# Altium schematic sheet Sheet1.SchDoc
size A4; SheetNumber: 1; SheetTotal: 1
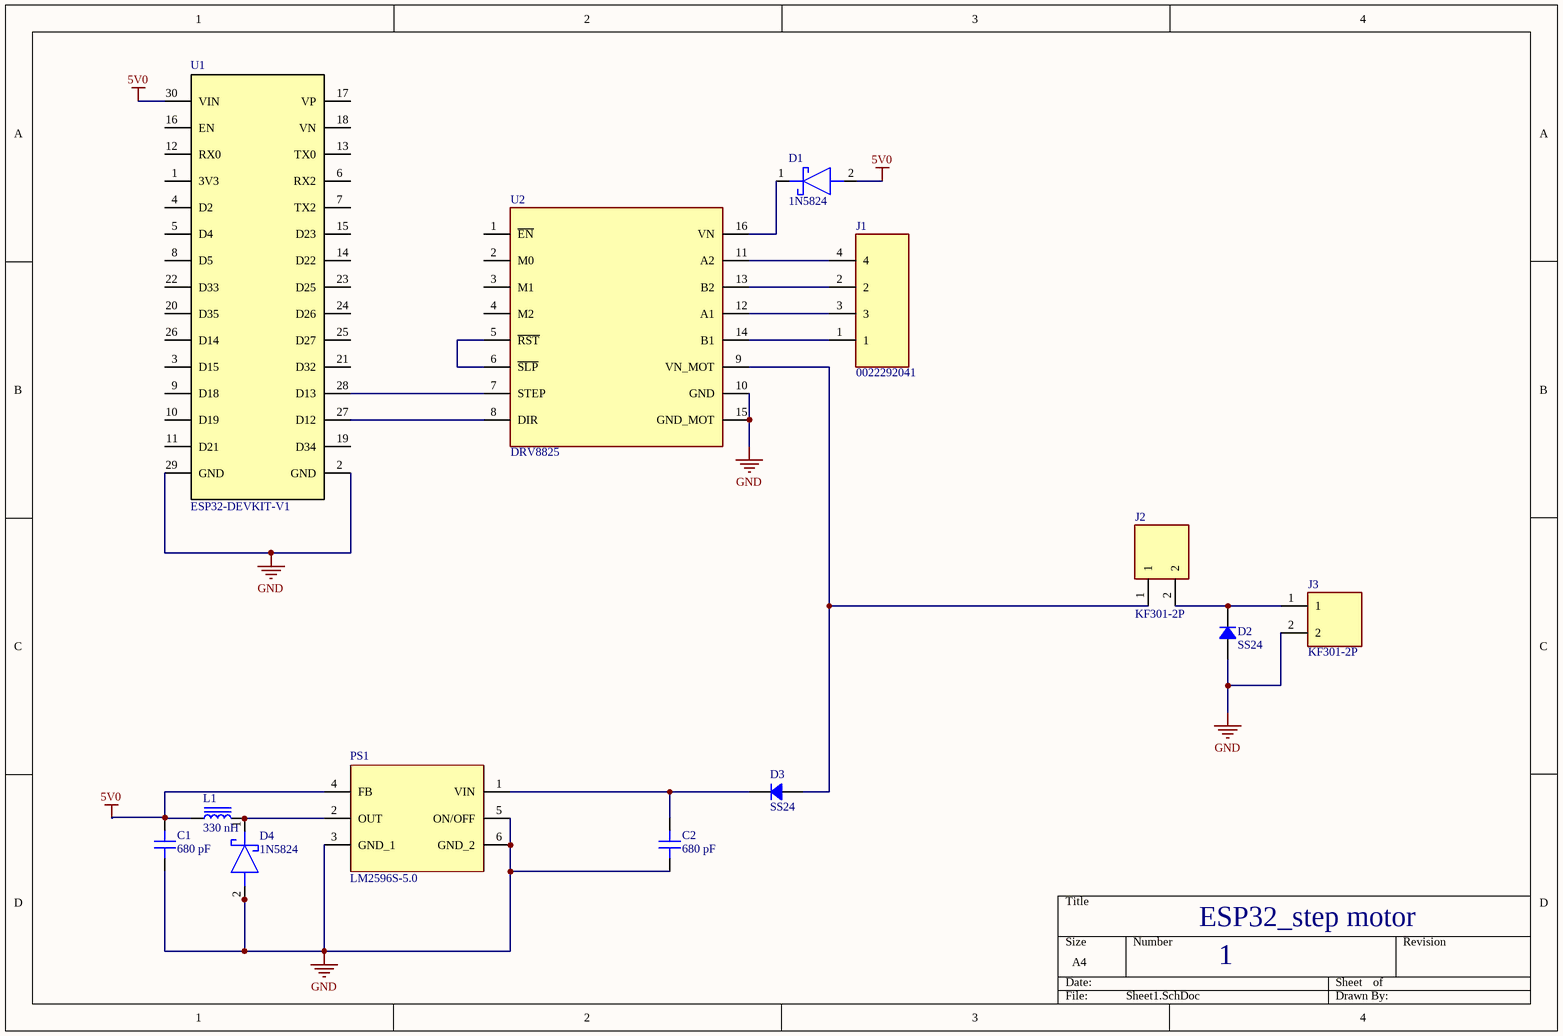
[diagram p0: Sheet1.SchDoc]

## Parts
C1  680 pF  [CAP 0603_1608]
C2  680 pF  [CAP 0603_1608]
D1  1N5824  [DIOM5026X262N]
D2  SS24  [DO214AA SMB]
D3  SS24  [DO214AA SMB]
D4  1N5824  [DIOM5026X262N]
J1  0022292041  [0022292041]
J2  KF301-2P  [HANDSON_KF301-2P]
J3  KF301-2P  [HANDSON_KF301-2P]
L1  330 nH  [BOURNS SRP5030T]
PS1  LM2596S-5.0  [KTT0005B]
U1  ESP32-DEVKIT-V1  [MODULE_ESP32_DEVKIT_V1]
U2  DRV8825  [IC_DRV8825_STEPPER_MOTOR_DRIVER_CARRIER]

## Nets
5V0: C1.2 D1.2(A) L1.1 PS1.4(FB) U1.30(VIN)
GND: C1.1 C2.1 D2.1 D4.2(A) J3.2 PS1.3(GND_1) PS1.5(ON/OFF) PS1.6(GND_2) U1.2(GND) U1.29(GND) U2.10(GND) U2.15(GND_MOT)
NetC2_2: C2.2 D3.2 PS1.1(VIN)
NetD1_1: D1.1(K) U2.16(VN)
NetD2_2: D2.2 J2.2 J3.1
NetD3_1: D3.1 J2.1 U2.9(VN_MOT)
NetD4_1: D4.1(K) L1.2 PS1.2(OUT)
NetJ1_1: J1.1 U2.14(B1)
NetJ1_2: J1.2 U2.13(B2)
NetJ1_3: J1.3 U2.12(A1)
NetJ1_4: J1.4 U2.11(A2)
NetU1_27: U1.27(D12) U2.8(DIR)
NetU1_28: U1.28(D13) U2.7(STEP)
NetU2_5: U2.5(~{RST}) U2.6(~{SLP})

Not connected (* = marked no-connect by the designer): U1 1(3V3) 3(D15) 4(D2) 5(D4) 6(RX2) 7(TX2) 8(D5) 9(D18) 10(D19) 11(D21) 12(RX0) 13(TX0) 14(D22) 15(D23) 16(EN) 17(VP) 18(VN) 19(D34) 20(D35) 21(D32) 22(D33) 23(D25) 24(D26) 25(D27) 26(D14); U2 1(~{EN}) 2(M0) 3(M1) 4(M2)

## Notes on the sheet
- ESP32_step motor
- 1

## Library data of the parts
C1 C2 = CC0603JRNPO9BN681: CAP CER 680PF 50V C0G/NPO 0603; manufacturer: Yageo; Temperature Coefficient: C0G, NP0; Tolerance: ±5%; Part Number: CC0603JRNPO9BN681; Capacitance: 680 pF; Applications: General Purpose; componentlink1description: Datasheet; componentlink1url: https://www.yageo.com/upload/media/product/productsearch/datasheet/mlcc/UPY-GP_NP0_16V-to-50V_17.pdf; componentlink2description: DigiKey Link; componentlink2url: https://www.digikey.com/en/products/detail/yageo/CC0603JRNPO9BN681/2833590; Device Package: 0603 (1608 Metric); lastupdated: 09.02.2024 20:10:17; Lifecycle Status: Active; Minimum Order: 1; Mounting Type: Surface Mount, MLCC; Operating Temperature: -55°C ~ 125°C; Package / Case: 0603 (1608 Metric); packaging: TapeAndReel; partid: 12488; Part Status: Active; price: 0.01; series: CC; Size / Dimension: 0.063" L x 0.031" W (1.60mm x 0.80mm); Supplier 1: DigiKey; Supplier Part Number 1: 311-1425-1-ND; Thickness (Max): 0.035" (0.90mm); value: 680 pF; Voltage - Rated: 50V
D1 D4 = 1N5824: Schottky Diode; Manufacturer_Name: Microchip; Datasheet Link: https://www.microsemi.com/document-portal/doc_download/5865-1n5823-25-datasheet; Height: 11.43mm; Manufacturer_Part_Number: 1N5824; Mouser Part Number: 494-1N5824; Mouser Price/Stock: https://www.mouser.co.uk/ProductDetail/Microchip-Technology/1N5824?qs=TXMzd3F6EyleEEWqakQxJw%3D%3D; Arrow Part Number: 1N5824; Arrow Price/Stock: https://www.arrow.com/en/products/1n5824/microchip-technology?utm_currency=USD&region=nac
D2 D3 = SS24: DIODE SCHOTTKY 40V 2A DO214AA; Manufacturer: ON Semiconductor; Current - Reverse Leakage @ Vr: 400µA @ 40V; Speed: Fast Recovery =< 500ns, > 200mA (Io); Voltage - Forward (Vf) (Max) @ If: 500mV @ 2A; Part Number: SS24; ComponentLink1Description: Datasheet; ComponentLink1URL: https://www.onsemi.com/pub/Collateral/SS29-D.pdf; ComponentLink2Description: DigiKey Link; ComponentLink2URL: http://digikey.com/product-detail/en/on-semiconductor/SS24/SS24FSCT-ND/1626273; Current - Average Rectified (Io): 2A; Diode Type: Schottky; LastUpdated: 03.06.2024 19:54:02; Lifecycle Status: Active; Minimum Order: 1; Mounting Type: Surface Mount; Operating Temperature - Junction: -65°C ~ 125°C; Package / Case: DO-214AA, SMB; Packaging: TapeAndReel; PartId: 1394; Part Status: Active; Price: 0.10; Series: -; Supplier 1: DigiKey; Supplier Part Number 1: SS24FSCT-ND; Supplier Device Package: DO-214AA (SMB); Voltage - DC Reverse (Vr) (Max): 40V
J1 = 0022292041: Connector; Manufacturer_Name: Molex; Datasheet Link: https://www.molex.com/pdm_docs/sd/022292041_sd.pdf; Height: 12.05mm; Manufacturer_Part_Number: 0022292041; Mouser Part Number: N/A; Mouser Price/Stock: https://www.mouser.co.uk/ProductDetail/Molex/0022292041?qs=PBcRNPEHKsq3yGXZ0ocRTw%3D%3D; Arrow Part Number: 0022292041; Arrow Price/Stock: https://www.arrow.com/en/products/0022292041/molex?region=europe
J2 J3 = KF301-2P: 2 Pin Terminal Block 5mm Pitch; Price: None; Value: *; MP: KF301-2P; Package: None; Availability: Unavailable
L1 = SRP5030T-R33M: FIXED IND 330NH 14A 5 MOHM SMD; Manufacturer: Bourns Inc.; Current - Saturation: 18A; DC Resistance (DCR): 5mOhm Max; Inductance Frequency - Test: 100 kHz; Material - Core: Iron Powder; Shielding: Shielded; Tolerance: ±20%; Type: Drum Core, Wirewound; Part Number: SRP5030T-R33M; ComponentLink1Description: Datasheet; ComponentLink1URL: https://www.bourns.com/docs/Product-Datasheets/SRP5030T.pdf; ComponentLink2Description: DigiKey Link; ComponentLink2URL: https://www.digikey.com/en/products/detail/bourns-inc/SRP5030T-R33M/3986076; Current Rating (Amps): 14 A; Device Package: Nonstandard; Height - Seated (Max): 0.118" (3.00mm); Inductance: 330 nH; LastUpdated: 03.06.2024 20:02:35; Lifecycle Status: Active; Minimum Order: 1; Mounting Type: Surface Mount; Operating Temperature: -40°C ~ 125°C; Package / Case: Nonstandard; Packaging: TapeAndReel; PartId: 4; Part Status: Active; Price: 0.59; Series: SRP5030T; Size / Dimension: 0.224" L x 0.205" W (5.70mm x 5.20mm); Supplier 1: DigiKey; Supplier Part Number 1: SRP5030T-R33MCT-ND; Value: 330 nH
U1 = ESP32-DEVKIT-V1: Dual core, Wi-Fi: 2.4 GHz up to 150 Mbits/s,BLE (Bluetooth Low Energy) and legacy Bluetooth, 32 bits, Up to 240 MHz; MF: Do it; Price: None; Availability: Not in stock; Package: None; MP: ESP32-DEVKIT-V1; Value: *; SnapEDA_Link: https://www.snapeda.com/parts/ESP32-DEVKIT-V1/Do+it/view-part/?ref=snap; Check_prices: https://www.snapeda.com/parts/ESP32-DEVKIT-V1/Do+it/view-part/?ref=eda
U2 = DRV8825_STEPPER_MOTOR_DRIVER_CARRIER: Stepper motor controler; IC: DRV8825; 1.5A; Uin mot: 8.2Ã·45V; Availability: Unavailable; MP: DRV8825_STEPPER_MOTOR_DRIVER_CARRIER; Value: *; Price: None; Package: None